# EAGLE design led tester (EAGLE 6.1)
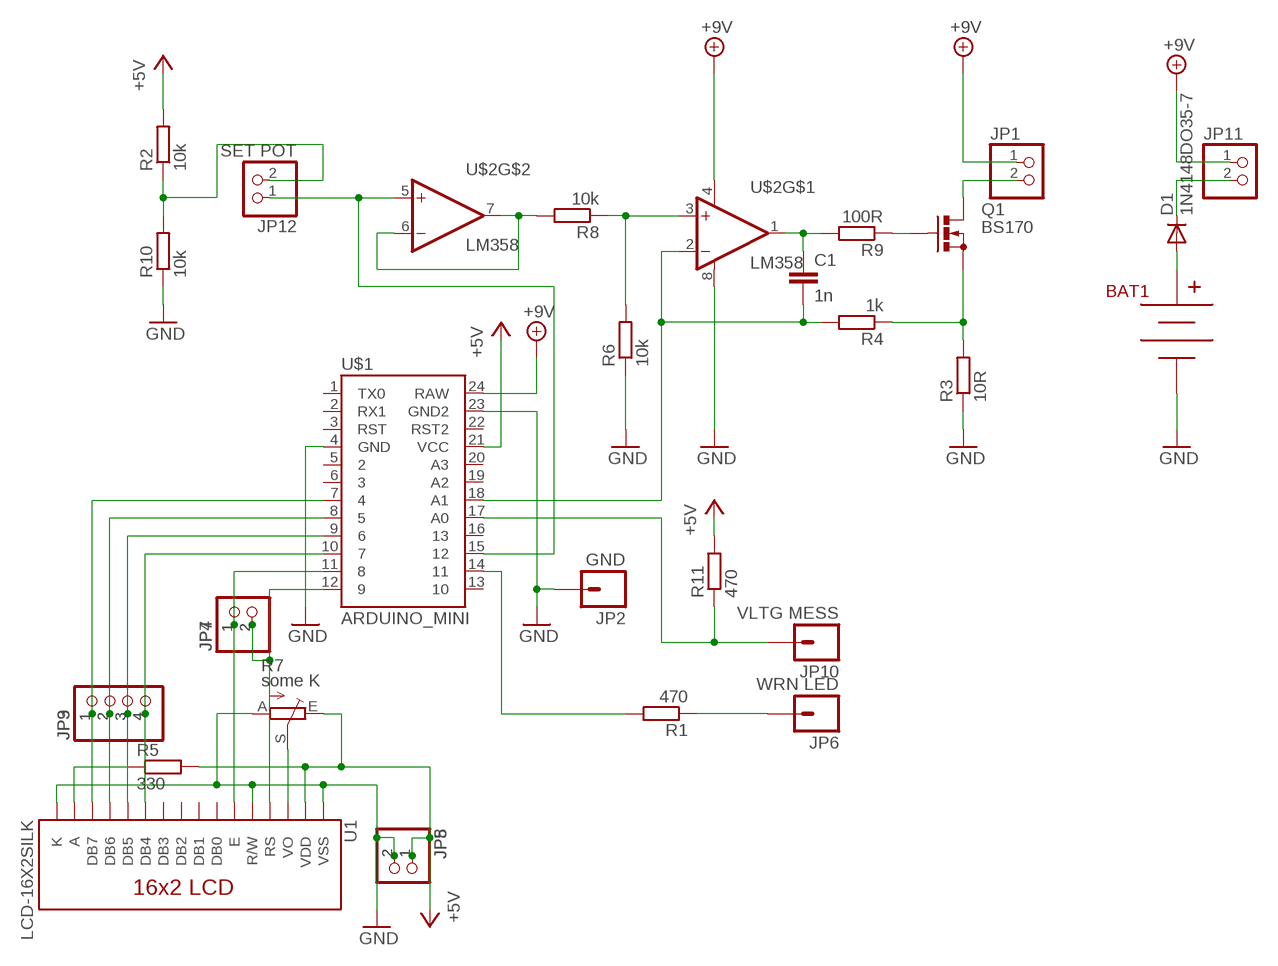
[diagram p0: schematic, sheet 1]

## Parts
BAT1  BC9VPC  [BC9VPC]
C1  1n  C-EU025-025X050  [C025-025X050]
D1  1N4148DO35-7  [DO35-7]
JP1  PINHD-1X2  [1X02]
JP2  GND  M01PTH_LONGPAD  [1X01_LONGPAD]
JP3  PINHD-1X4  [1X04]
JP4  PINHD-1X2  [1X02]
JP5  PINHD-1X2  [1X02]
JP6  WRN LED  M01PTH_LONGPAD  [1X01_LONGPAD]
JP7  PINHD-1X2  [1X02]
JP8  PINHD-1X2  [1X02]
JP9  PINHD-1X4  [1X04]
JP10  VLTG MESS  M01PTH_LONGPAD  [1X01_LONGPAD]
JP11  PINHD-1X2  [1X02]
JP12  SET POT  PINHD-1X2  [1X02]
Q1  BS170  [SOT54E]
R1  470  R-EU_0204/7  [0204/7]
R2  10k  R-EU_0204/7  [0204/7]
R3  10R  R-EU_0207/10  [0207/10]
R4  1k  R-EU_0204/7  [0204/7]
R5  330  R-EU_0204/7  [0204/7]
R6  10k  R-EU_0204/7  [0204/7]
R7  some K  TRIM_EU-S63P  [S63P]
R8  10k  R-EU_0204/7  [0204/7]
R9  100R  R-EU_0204/7  [0204/7]
R10  10k  R-EU_0204/7  [0204/7]
R11  470  R-EU_0204/7  [0204/7]
U1  LCD-16X2SILK  [LCD-16X2]
U$1  ARDUINO_MINI  [ARDUINO_MINI]
U$2  LM358  [DIP08]

## Nets
+5V: JP5.1 JP8.1 R2.2 R5.2 R7.E R11.2 U1.2(VDD) U$1.21(VCC)
+9V: JP1.1 JP11.1 U$1.24(RAW) U$2.4(V-)
GND: BAT1.V- JP2.1 JP5.2 JP8.2 R3.1 R6.1 R7.A R10.1 U1.1(VSS) U1.5(R/W) U1.16(K) U$1.4(GND) U$1.23(GND2) U$2.8(V+)
N$1: Q1.S R3.2 R4.1
N$2: JP1.2 Q1.D
N$3: JP10.1 R11.1 U$1.17(A0)
N$4: R6.2 R8.1 U$2.3(+IN)
N$5: R8.2 U$2.6(-IN) U$2.7(OUT)
N$6: JP12.2 R2.1 R10.2
N$7: D1.C JP11.2
N$8: R1.2 U$1.14
N$9: BAT1.V+ D1.A
N$10: JP6.1 R1.1
N$11: JP12.1 U$1.15 U$2.5(+IN)
N$12: R7.S U1.3(VO)
N$13: R5.1 U1.15(A)
N$14: C1.1 R9.2 U$2.1(OUT)
N$15: C1.2 R4.2 U$1.18(A1) U$2.2(-IN)
N$16: JP4.2 JP7.2 U1.4(RS) U$1.12
N$17: JP4.1 JP7.1 U1.6(E) U$1.11
N$18: JP3.4 JP9.4 U1.11(DB4) U$1.10
N$19: JP3.3 JP9.3 U1.12(DB5) U$1.9
N$20: JP3.2 JP9.2 U1.13(DB6) U$1.8
N$21: JP3.1 JP9.1 U1.14(DB7) U$1.7
N$22: Q1.G R9.1
Unconnected: U1.7(DB0) U1.8(DB1) U1.9(DB2) U1.10(DB3) U$1.1(TX0) U$1.2(RX1) U$1.3(RST) U$1.5 U$1.6 U$1.13 U$1.16 U$1.19(A2) U$1.20(A3) U$1.22(RST2)

## Library data of the parts
BAT1 = SparkFun-Connectors:BC9VPC: 9V board-mount battery cradle
C1 = rcl:C-EU: CAPACITOR, European symbol
D1 = diode:1N4148: DIODE high speed (Philips)
JP1 JP4 JP5 JP7 JP8 JP11 JP12 = pinhead:PINHD-1X2: PIN HEADER
JP2 JP6 JP10 = SparkFun:M01: Header 1 Standard 1-pin 0.1" header. Use with straight break away headers (SKU : PRT-00116), right angle break away headers (PRT-00553), swiss pins (PRT-00743), machine pins (PRT-00117), and female headers (PRT-00115).
JP3 JP9 = pinhead:PINHD-1X4: PIN HEADER
Q1 = transistor-small-signal:BS170: N-CHANNEL MOS FET
R1-R6 R8-R11 = rcl:R-EU_: RESISTOR, European symbol
R7 = pot:TRIM_EU-: POTENTIOMETER
U1 = SparkFun-Displays:LCD-16X2: Standard text-only 16x2 parallel input LCD
U$1 = SparkFun-Boards:ARDUINO_MINI: Arduino Pro Mini footprint
U$2 = SparkFun-AnalogIC:LM358: Jellybean op-amp

## Board
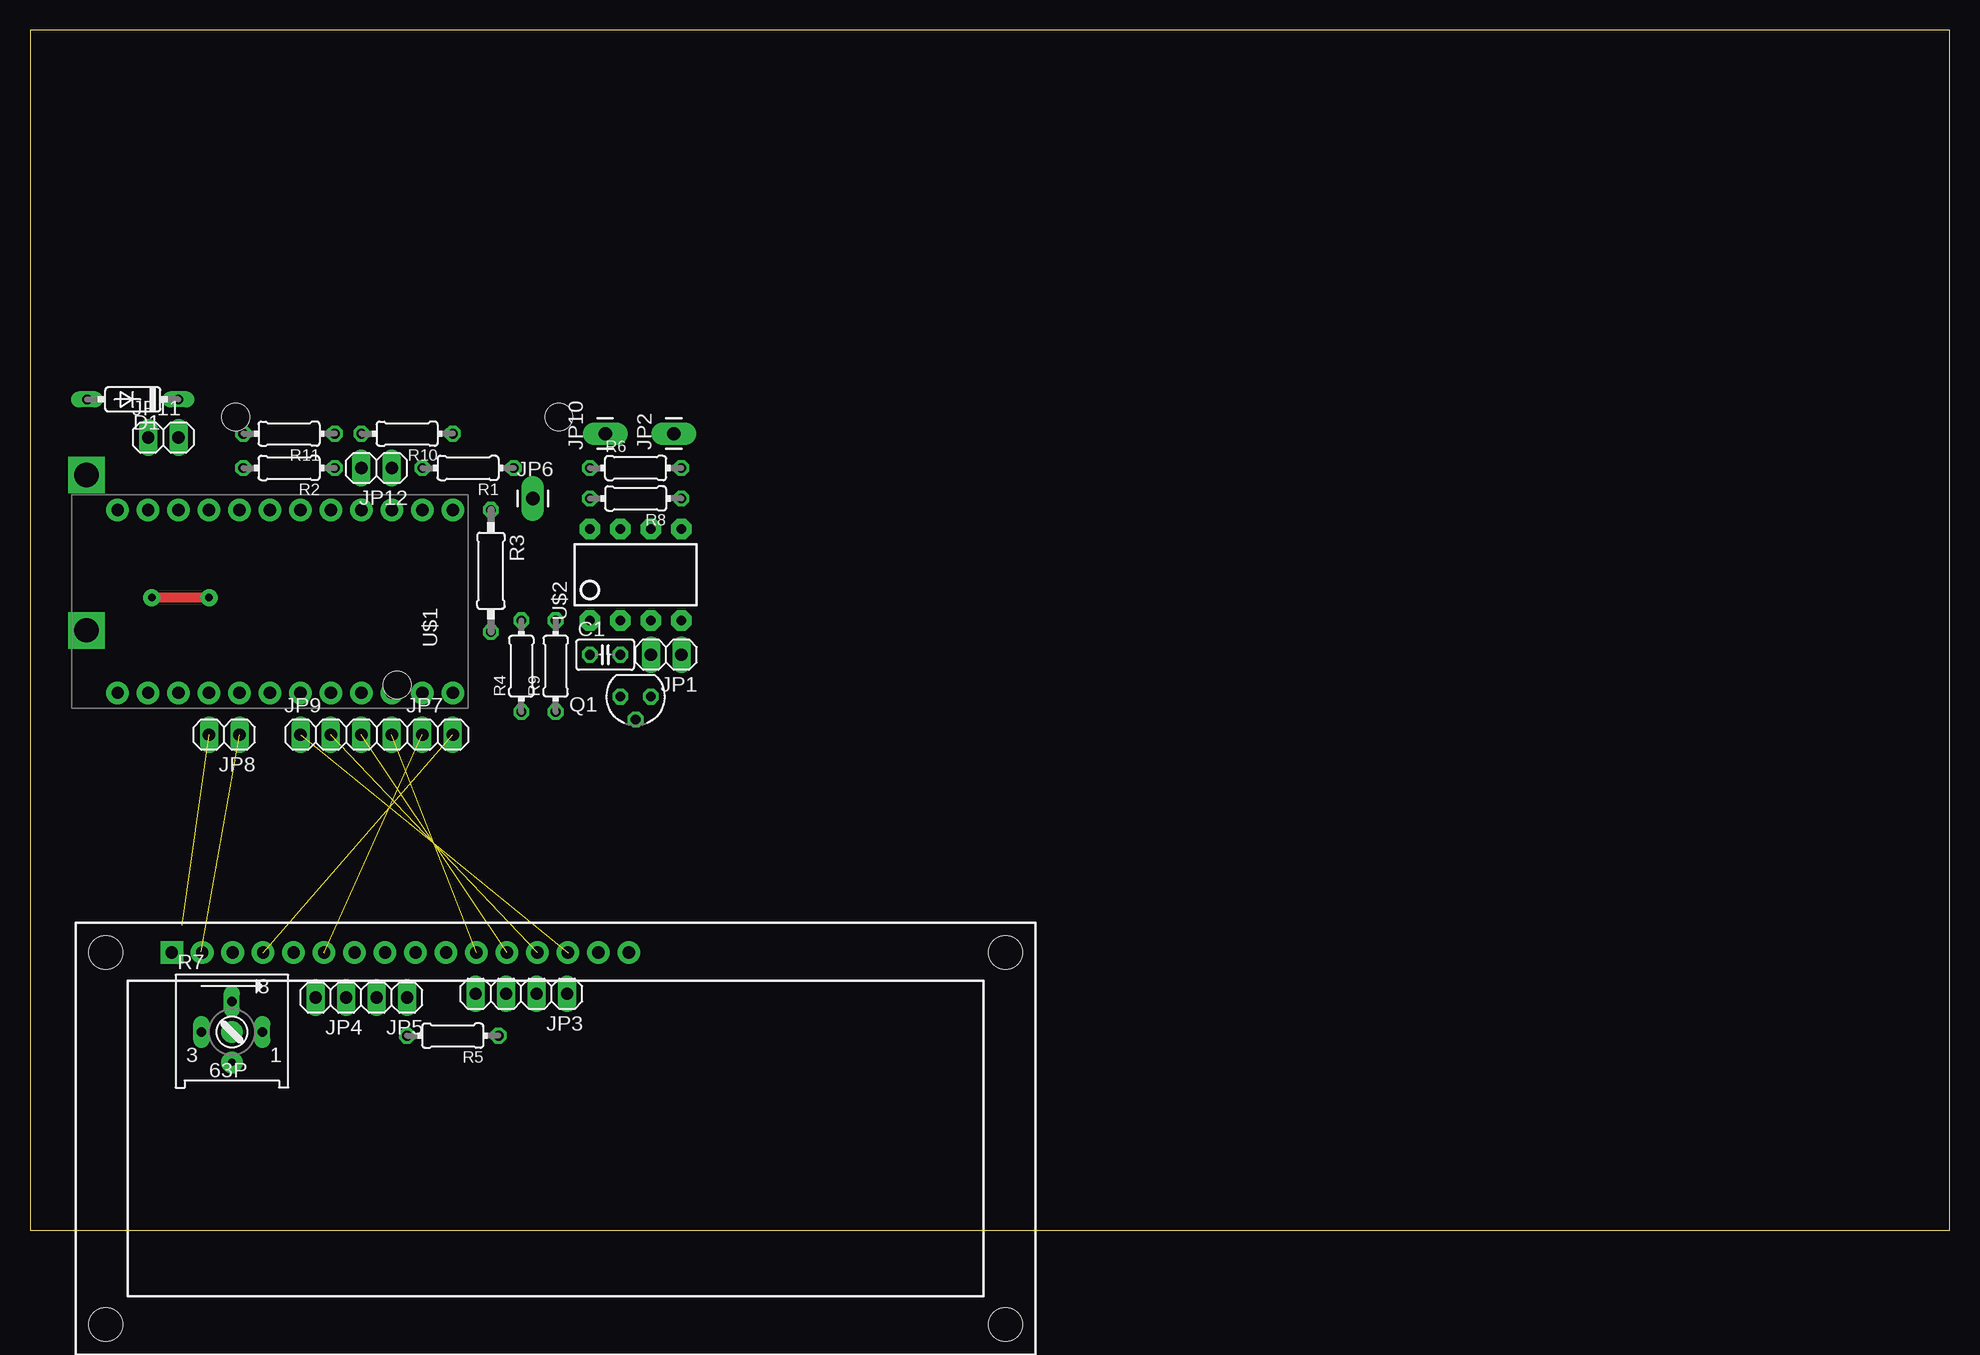
[diagram p1: board, top side]
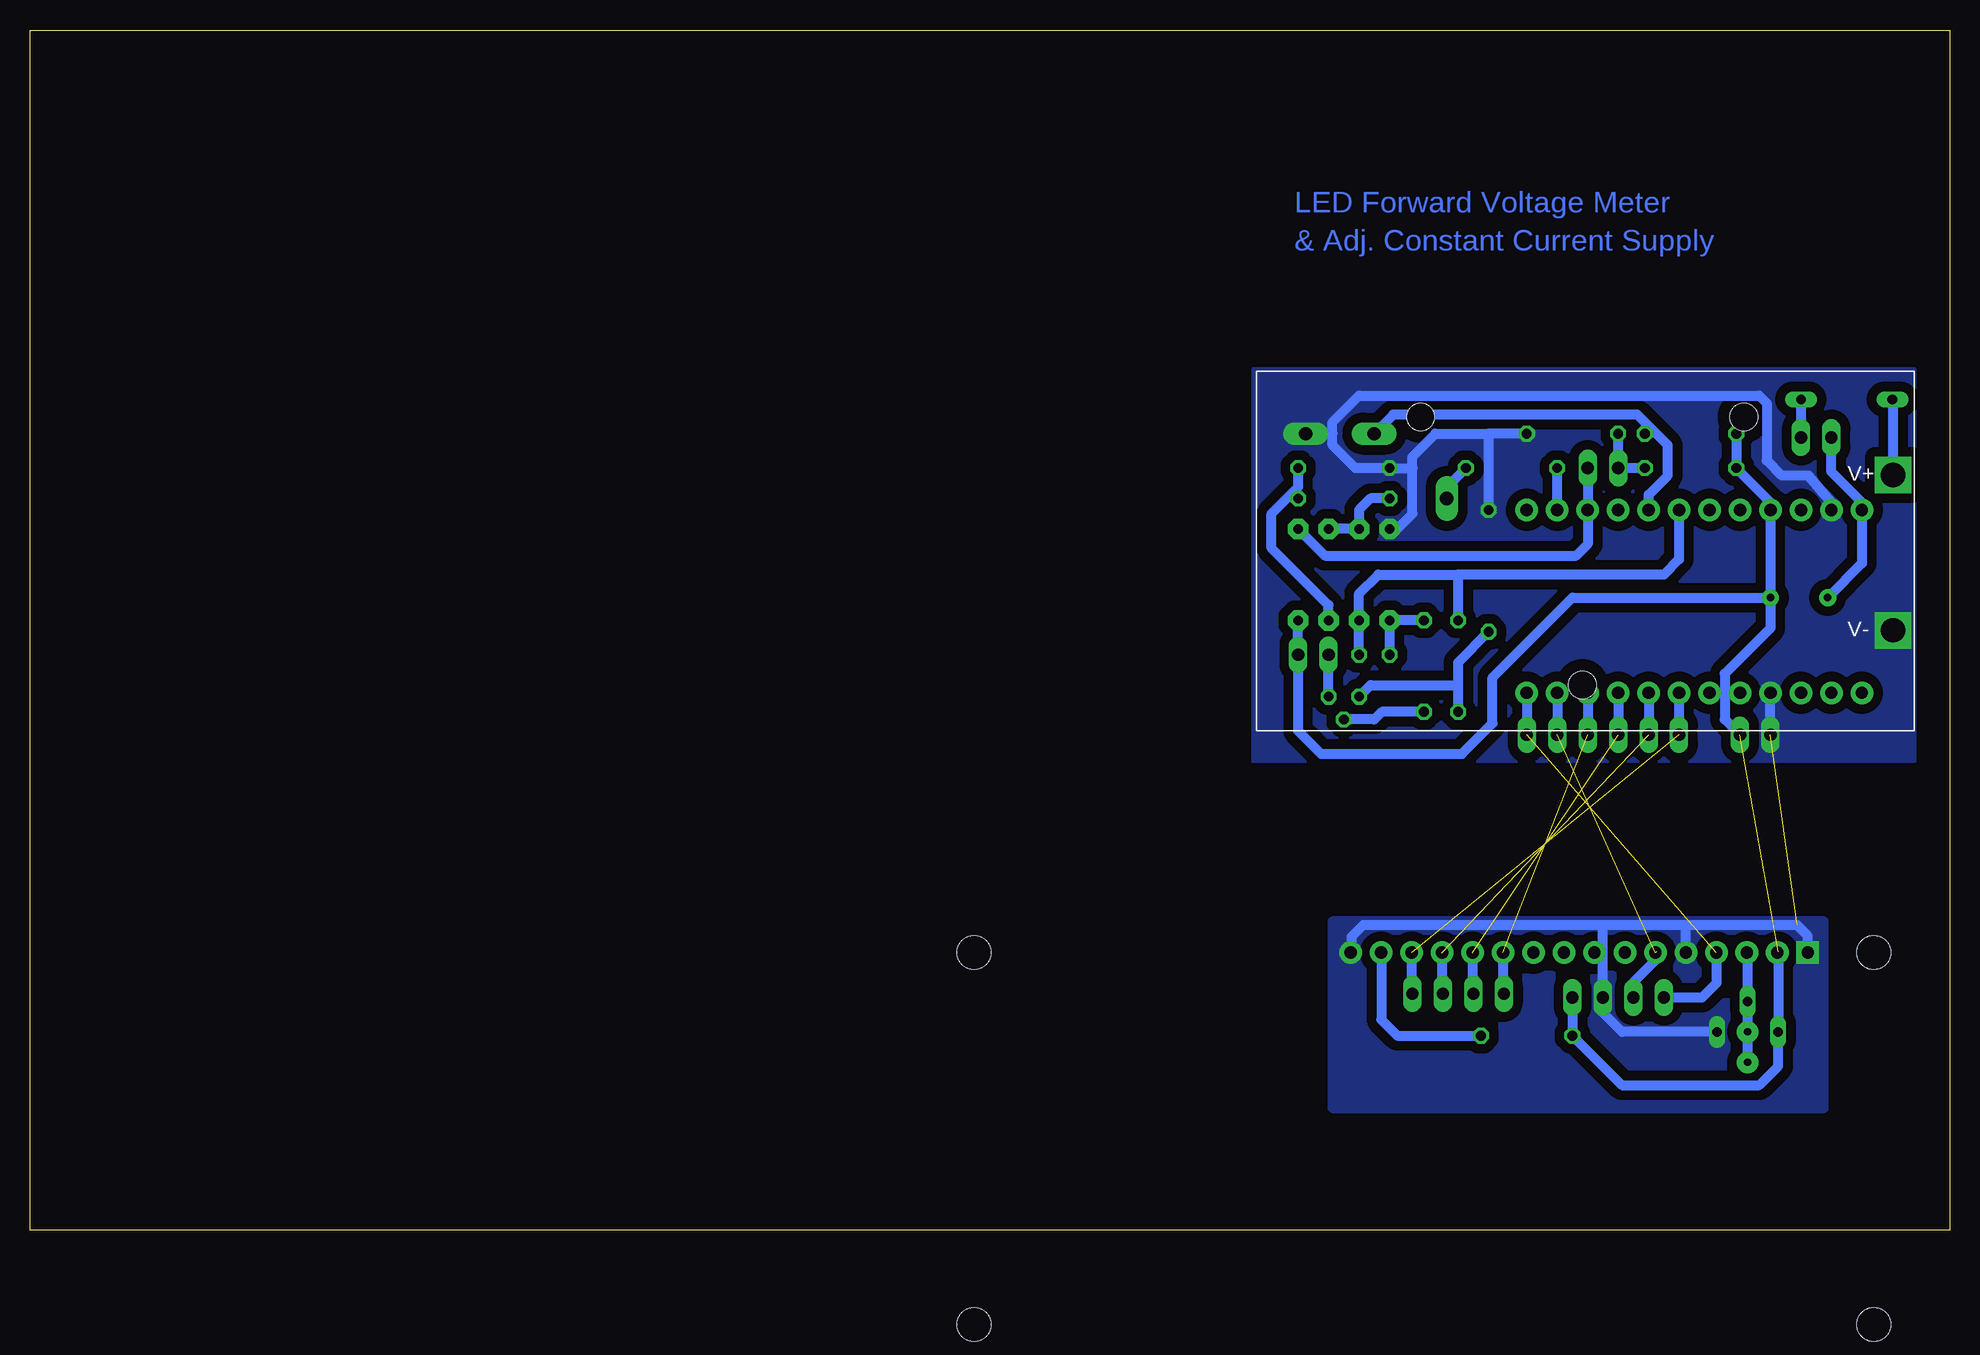
[diagram p2: board, bottom side, seen from below]

Size 160 x 100 mm. Coordinates in mm from the lower left corner, seen from the top.
Outline: 0,0 160,0 160,100 0,100 0,0
Copper layers (1*16): Top 0.035mm / dielectric 1.5mm / Bottom 0.035mm
Design rules: minimum track width 10mil, minimum drill 24mil, track to track 8mil, track to pad 8mil, pad to pad 8mil, via to via 8mil, smd to smd 8mil, copper to edge 40mil, drill to drill 8mil, minimum pad ring 10mil, minimum via ring 8mil, stop-mask expansion 4mil, vias tented up to drill 0mil, thermal gap 10mil

### Footprints (pad centres in the part's own frame; a part is rotated, then mirrored left to right if it is on the bottom)
BC9VPC = drill 2.032 square: V+ 53.086,21.336; V- 53.086,8.382 | hole 2.286: 27.178,3.81; 13.716,26.162; 40.64,26.162
C025-025X050 = drill 0.813 octagon: 1 -1.27,0; 2 1.27,0
DO35-7 = drill 0.813 long: A 3.81,0; C -3.81,0
1X02 = drill 1.016 long: 1 -1.27,0; 2 1.27,0
1X01_LONGPAD = drill 1.118 pad 1.88 long: 1 0,0
1X04 = drill 1.016 long: 1 -3.81,0; 2 -1.27,0; 3 1.27,0; 4 3.81,0
SOT54E = drill 0.813 octagon: D -1.27,0; G 0,1.905; S 1.27,0
0204/7 = drill 0.813 octagon: 1 -3.81,0; 2 3.81,0
0207/10 = drill 0.813 octagon: 1 -5.08,0; 2 5.08,0
S63P = drill 0.813 long: A 2.54,0; E -2.54,0; S 0,2.54
LCD-16X2 = drill 1.016 pad 1.88 square: 1 -32,15.5 | drill 1.016 pad 1.88: 2 -29.46,15.5; 3 -26.92,15.5; 4 -24.38,15.5; 5 -21.84,15.5; 6 -19.3,15.5; 7 -16.76,15.5; 8 -14.22,15.5; 9 -11.68,15.5; 10 -9.14,15.5; 11 -6.6,15.5; 12 -4.06,15.5; 13 -1.52,15.5; 14 1.02,15.5; 15 3.56,15.5; 16 6.1,15.5 | hole 2.8: -37.5,15.5; -37.5,-15.5; 37.5,15.5; 37.5,-15.5
ARDUINO_MINI = drill 1.016 pad 1.88: 1 -7.62,12.7; 2 -7.62,10.16; 3 -7.62,7.62; 4 -7.62,5.08; 5 -7.62,2.54; 6 -7.62,0; 7 -7.62,-2.54; 8 -7.62,-5.08; 9 -7.62,-7.62; 10 -7.62,-10.16; 11 -7.62,-12.7; 12 -7.62,-15.24; 13 7.62,-15.24; 14 7.62,-12.7; 15 7.62,-10.16; 16 7.62,-7.62; 17 7.62,-5.08; 18 7.62,-2.54; 19 7.62,0; 20 7.62,2.54; 21 7.62,5.08; 22 7.62,7.62; 23 7.62,10.16; 24 7.62,12.7
DIP08 = drill 0.813 pad 1.727 octagon: 1 -3.81,-3.81; 2 -1.27,-3.81; 3 1.27,-3.81; 4 3.81,-3.81; 5 3.81,3.81; 6 1.27,3.81; 7 -1.27,3.81; 8 -3.81,3.81

### Placement (x,y rotation side)
BAT1  57.78,41.59 0 bottom
C1  47.94,47.94 0 top
D1  8.57,69.22 180 top
JP1  53.02,47.94 180 top
JP2  53.66,66.36 90 top
JP3  40.96,19.68 180 top
JP4  25.08,19.37 180 top
JP5  30.16,19.37 180 top
JP6  41.91,60.96 0 top
JP7  33.97,41.27 0 top
JP8  16.19,41.27 180 top
JP9  26.35,41.27 0 top
JP10  47.94,66.36 90 top
JP11  11.11,66.04 0 top
JP12  28.89,63.5 180 top
Q1  50.48,44.45 180 top
R1  36.51,63.5 180 top
R2  21.59,63.5 180 top
R3  38.42,54.93 270 top
R4  40.96,46.99 90 top
R5  35.24,16.19 180 top
R6  50.48,63.5 0 top
R7  16.83,16.51 0 top
R8  50.48,60.96 180 top
R9  43.81,46.99 90 top
R10  31.43,66.36 180 top
R11  21.59,66.36 180 top
U1  43.81,7.62 0 top
U$1  20,52.39 90 top
U$2  50.48,54.61 0 top

### Tracks (layer width: path | path; a pad name or v marks a point on that pad's centre or on a via)
+5V  (1 unrouted)
  Bottom 0.813: 14.29,23.19 U1.2 14.29,23.12 R7.E 14.29,13.65 15.88,12.06 27.3,12.06 R5.2 JP5.1 | R11.2 R2.2 14.92,60.64 U$1.21 14.92,50.16 18.73,46.35 18.73,42.55 JP8.1
+9V  (via drill 0.6 pad 1.42)
  Top 0.813: v14.92,52.7 v10.16,52.7
  Bottom 0.813: v14.92,52.7 31.43,52.7 38.1,46.04 38.1,42.23 40.64,39.69 52.39,39.69 54.29,41.59 JP1.1 U$2.4 | v10.16,52.7 7.3,55.56 U$1.24 7.3,60.64 9.84,63.18 JP11.1
GND  (1 unrouted)
  Bottom 0.813: U1.1 11.81,24.52 12.7,25.4 21.91,25.4 | 21.91,25.4 28.89,25.4 | 28.89,25.4 48.9,25.4 49.85,24.45 49.85,23.19 U1.16 | U1.5 21.98,25.33 21.91,25.4 | 28.89,25.4 JP5.2 28.89,18.1 27.3,16.51 R7.A | JP8.2 U$1.4 | 51.44,66.36 51.44,65.41 49.53,63.5 R6.1 44.77,63.5 | JP2.1 51.44,66.36 | U$2.8 46.04,58.42 44.77,59.69 44.77,63.5 | 44.77,63.5 44.77,64.45 42.86,66.36 38.42,66.36 | R10.1 38.42,66.36 | 38.42,66.36 R3.1 | 51.44,66.36 51.44,67.31 49.21,69.53 15.88,69.53 15.24,68.9 15.24,64.14 13.97,62.87 11.75,62.87 9.84,60.64 U$1.23
  pour Bottom (isolate 0.813, no thermals): 10.48,25.72 51.44,25.72 51.44,10.16 10.48,10.16
  pour Bottom (isolate 0.813, no thermals): 2.86,71.75 58.1,71.75 58.1,39.05 2.86,39.05
N$1
  Bottom 0.813: Q1.S 48.26,45.4 40.96,45.4 | 40.96,45.4 40.96,47.31 R3.2 | R4.1 40.96,45.4
N$2
  Bottom 0.813: Q1.D JP1.2
N$3
  Bottom 0.813: U$1.17 25.08,61.28 23.5,62.87 23.5,65.41 24.92,66.83 | 24.92,66.83 26.04,67.94 46.35,67.94 JP10.1 | R11.1 24.92,66.83
N$4
  Bottom 0.813: U$2.3 51.75,52.07 56.52,56.83 56.52,59.69 54.77,61.44 | R6.2 54.29,61.91 54.77,61.44 | R8.1 54.77,61.44
N$5
  Bottom 0.813: U$2.6 U$2.7 49.21,60.01 48.26,60.96 R8.2
N$6
  Bottom 0.813: R2.1 JP12.2 R10.2
N$7
  Bottom 0.813: D1.C JP11.2
N$8
  Bottom 0.813: U$1.14 R1.2
N$9
  Bottom 0.813: BAT1.V+ 4.7,69.15 D1.A
N$10
  Bottom 0.813: R1.1 41.91,61.91 JP6.1
N$11
  Bottom 0.813: U$2.5 52.07,56.2 31.11,56.2 30.16,57.15 U$1.15 JP12.1
N$12  (via drill 0.6 pad 1.78)
  Bottom 0.813: v16.83,13.97 v16.83,16.51 R7.S 16.83,23.05 U1.3
N$13
  Bottom 0.813: U1.15 47.38,17.53 46.04,16.19 R5.1
N$14
  Bottom 0.813: R9.2 U$2.1 C1.1
N$15
  Bottom 0.813: C1.2 U$2.2 49.21,53.02 47.62,54.61 40.96,54.61 | U$1.18 22.54,55.88 23.81,54.61 40.96,54.61 | R4.2 40.96,54.61
N$16  (1 unrouted)
  Bottom 0.813: U$1.12 JP7.2 | U1.4 19.43,20.57 20.64,19.37 JP4.2
N$17  (2 unrouted)
  Bottom 0.813: U$1.11 JP7.1 | 24.45,23.18 24.45,22.54 26.35,20.64 JP4.1
N$18  (1 unrouted)
  Bottom 0.813: U1.11 37.22,19.75 JP3.4 | U$1.10 JP9.4
N$19  (1 unrouted)
  Bottom 0.813: U1.12 39.76,19.75 JP3.3 | U$1.9 JP9.3
N$20  (1 unrouted)
  Bottom 0.813: U1.13 42.3,19.75 JP3.2 | U$1.8 JP9.2
N$21  (1 unrouted)
  Bottom 0.813: U1.14 44.84,19.75 JP3.1 | U$1.7 JP9.1
N$22
  Bottom 0.813: R9.1 47.31,43.18 47.94,42.55 Q1.G

### Text on the board
Bottom: LED Forward Voltage Meter | & Adj. Constant Current Supply